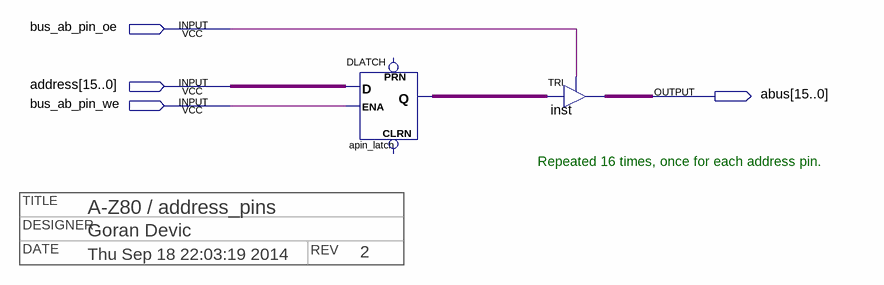
[diagram p0: schematic sheet]
// Quartus schematic address_pins.bdf as structural Verilog: 2 symbols, 4 pins
// Title block: DATE: Thu Sep 18 22:03:19 2014; DESIGNER: Goran Devic; REV: 2; TITLE: A-Z80 / address_pins
module address_pins (
  input  bus_ab_pin_oe,
  input  [15:0] address,
  input  bus_ab_pin_we,
  output [15:0] abus
);

  wire [15:0] apin_latch_q;

  DLATCH apin_latch[15:0] (.D(address), .ENA(bus_ab_pin_we), .Q(apin_latch_q));  // open: CLRN, PRN
  TRI inst[15:0] (.IN(apin_latch_q), .OE(bus_ab_pin_oe), .OUT(abus));

  // Notes on the sheet:
  //   Repeated 16 times, once for each address pin.
endmodule
